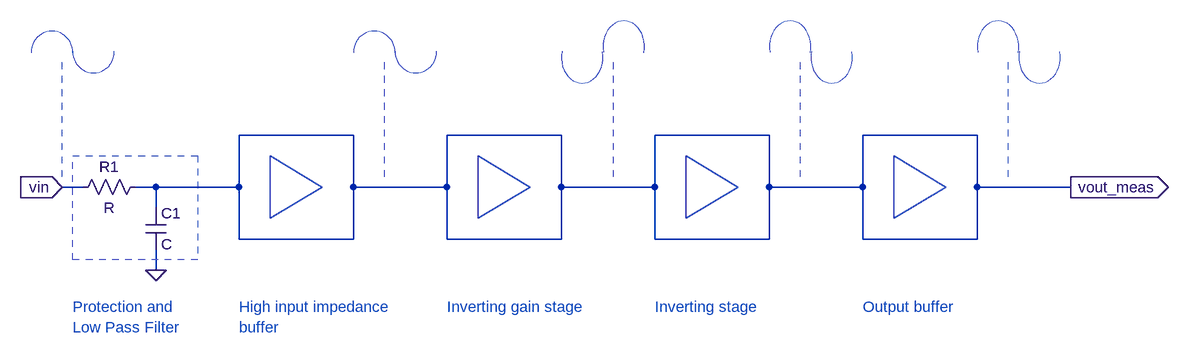
[diagram p0: schematic DC-DC G&W_analog_block.asc]
DC-DC G&W_analog_block.asc, the LTspice schematic file:
Version 4
SHEET 1 1752 680
WIRE 448 64 272 64
WIRE 768 64 592 64
WIRE 1088 64 912 64
WIRE 1408 64 1232 64
WIRE 32 144 0 144
WIRE 144 144 112 144
WIRE 272 144 272 64
WIRE 272 144 144 144
WIRE 448 144 448 64
WIRE 592 144 592 64
WIRE 592 144 448 144
WIRE 768 144 768 64
WIRE 912 144 912 64
WIRE 912 144 768 144
WIRE 1088 144 1088 64
WIRE 1232 144 1232 64
WIRE 1232 144 1088 144
WIRE 1408 144 1408 64
WIRE 1552 144 1408 144
WIRE 144 176 144 144
WIRE 272 224 272 144
WIRE 448 224 448 144
WIRE 448 224 272 224
WIRE 592 224 592 144
WIRE 768 224 768 144
WIRE 768 224 592 224
WIRE 912 224 912 144
WIRE 1088 224 1088 144
WIRE 1088 224 912 224
WIRE 1232 224 1232 144
WIRE 1408 224 1408 144
WIRE 1408 224 1232 224
WIRE 144 272 144 240
FLAG 0 144 vin
IOPIN 0 144 In
FLAG 144 272 0
FLAG 1552 144 vout_meas
IOPIN 1552 144 Out
SYMBOL res 128 128 R90
WINDOW 0 0 56 VBottom 2
WINDOW 3 32 56 VTop 2
SYMATTR InstName R1
SYMBOL cap 128 176 R0
SYMATTR InstName C1
TEXT 16 328 Left 2 ;Protection and \nLow Pass Filter
TEXT 272 328 Left 2 ;High input impedance\nbuffer
TEXT 592 328 Left 2 ;Inverting gain stage
TEXT 912 328 Left 2 ;Inverting stage
TEXT 1232 328 Left 2 ;Output buffer
LINE Normal 0 128 0 -48 2
LINE Normal 320 192 320 96
LINE Normal 400 144 320 192
LINE Normal 320 96 400 144
LINE Normal 640 192 640 96
LINE Normal 720 144 640 192
LINE Normal 640 96 720 144
LINE Normal 960 192 960 96
LINE Normal 1040 144 960 192
LINE Normal 960 96 1040 144
LINE Normal 1280 192 1280 96
LINE Normal 1360 144 1280 192
LINE Normal 1280 96 1360 144
LINE Normal 496 128 496 -48 2
LINE Normal 848 128 848 -48 2
LINE Normal 1136 128 1136 -48 2
LINE Normal 1456 128 1456 -48 2
RECTANGLE Normal 208 256 16 96 2
ARC Normal 16 -32 80 -96 17 -65 83 -65 2
ARC Normal 16 -96 -48 -32 15 -63 -51 -63 2
ARC Normal 512 -32 576 -96 513 -65 579 -65 2
ARC Normal 512 -96 448 -32 511 -63 445 -63 2
ARC Normal 768 -16 832 -96 769 -65 835 -65 2
ARC Normal 896 -112 832 -32 895 -63 829 -63 2
ARC Normal 1152 -16 1216 -96 1153 -65 1219 -65 2
ARC Normal 1152 -112 1088 -32 1151 -63 1085 -63 2
ARC Normal 1472 -16 1536 -96 1473 -65 1539 -65 2
ARC Normal 1472 -112 1408 -32 1471 -63 1405 -63 2

The netlist it stands for:
* DC-DC G&W_analog_block.asc
R1 vout_meas vin R
C1 vout_meas 0 C
* Protection and
* Low Pass Filter
* High input impedance
* buffer
* Inverting gain stage
* Inverting stage
* Output buffer
.backanno
.end